# Altium schematic sheet BlockDiagram.SchDoc: BLOCK DIAGRAM
size 420 x 297 mm; Revision: 1.0; SheetNumber: 1; SheetTotal: 1
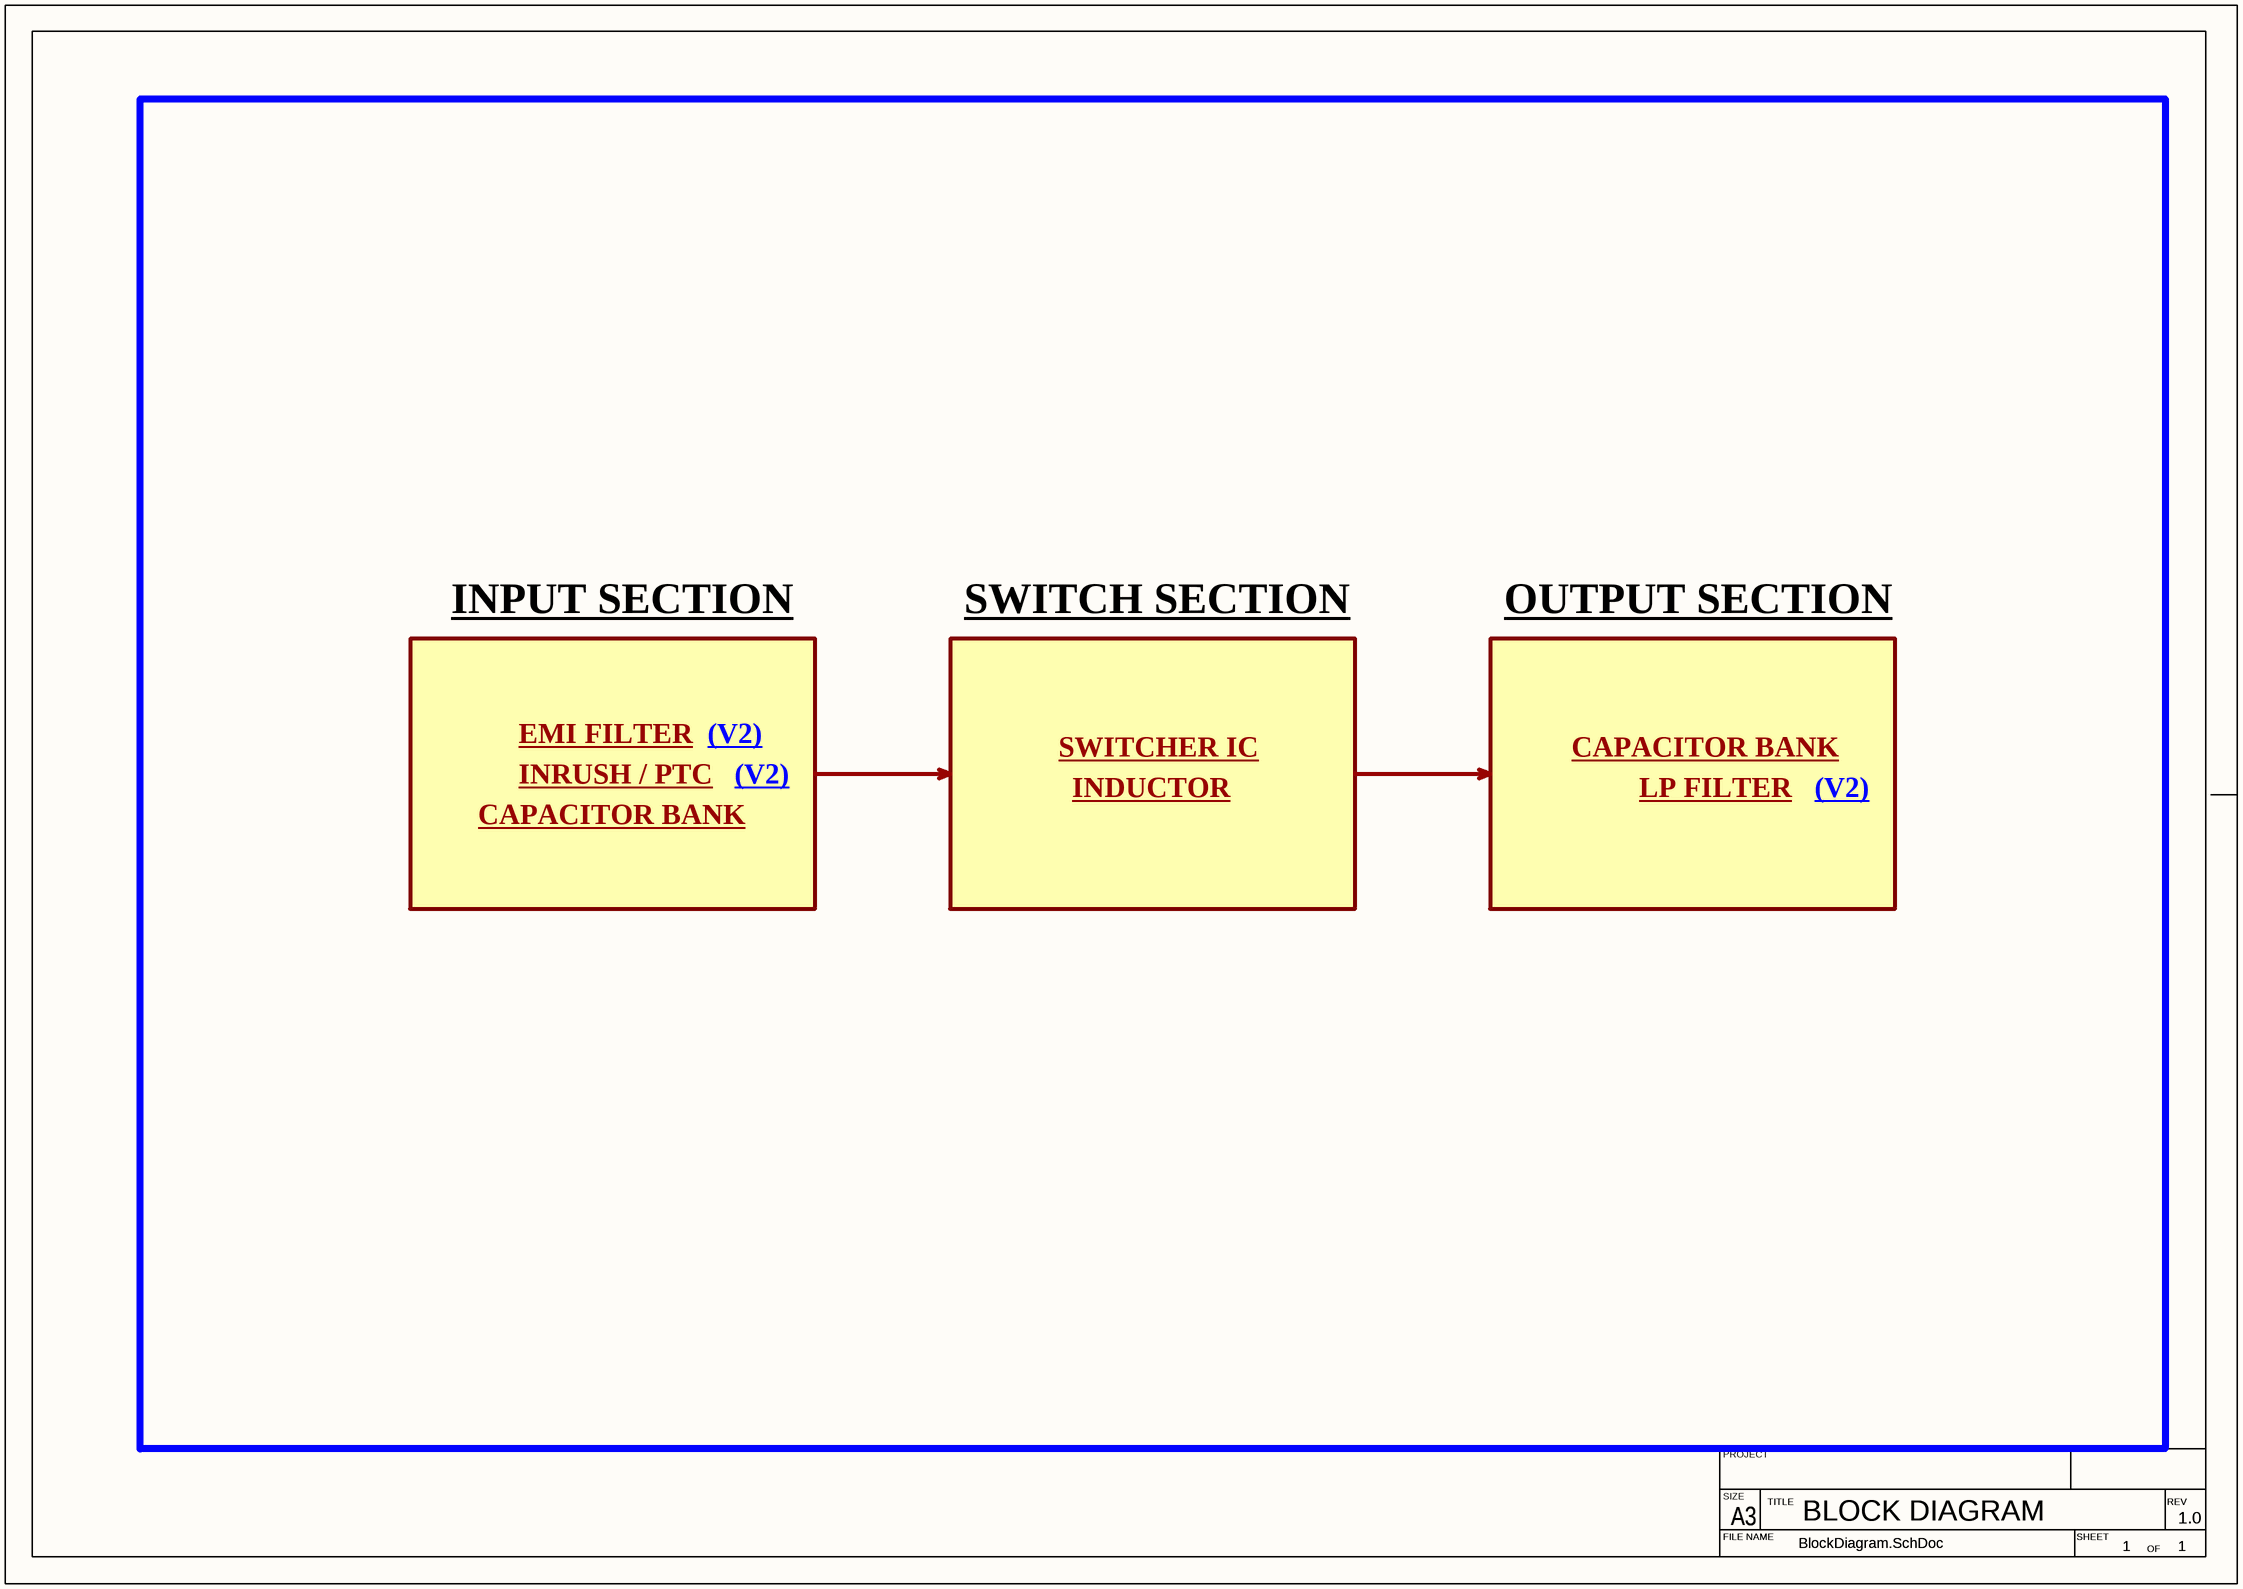
[diagram p0: BlockDiagram.SchDoc]

## Notes on the sheet
- INPUT SECTION
- SWITCH SECTION
- OUTPUT SECTION
- EMI FILTER
- (V2)
- INRUSH / PTC
- SWITCHER IC
- INDUCTOR
- CAPACITOR BANK
- LP FILTER
- PROJECT
- SIZE
- FILE NAME
- A3
- TITLE
- SHEET
- OF
- REV